# EAGLE schematic schematic-v1 (EAGLE 8.7.0)
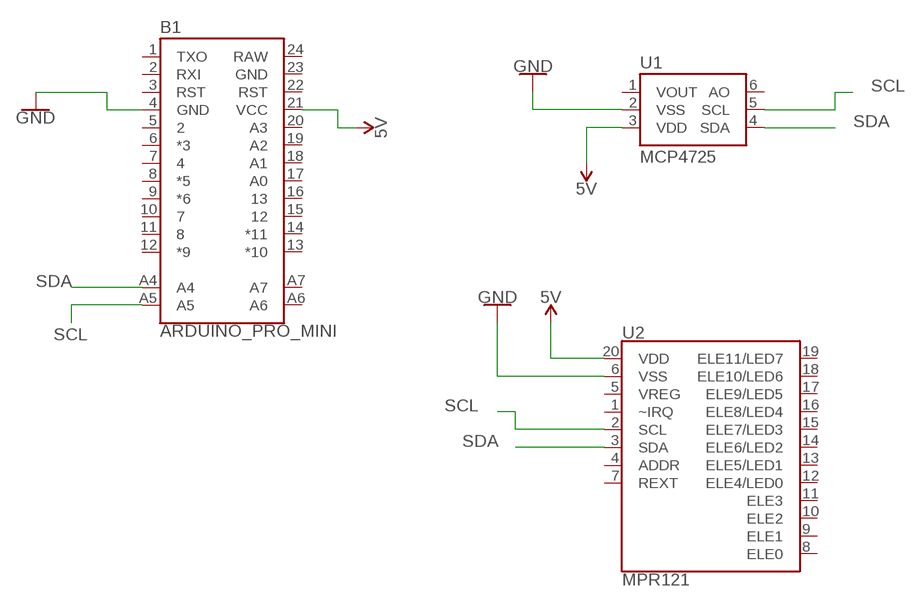
[diagram p0: schematic, sheet 1]

## Parts
B1  ARDUINO_PRO_MINI  [ARDUINO_PRO_MINI]
U1  MCP4725  MCP4725SOT-23  [SOT23-6]
U2  MPR121  [QFN-20]

## Nets
5V: B1.21(VCC) U1.3(VDD) U2.20(VDD)
GND: B1.4(GND) U1.2(VSS) U2.6(VSS)
SCL: B1.A5 U1.5(SCL) U2.2(SCL)
SDA: B1.A4 U1.4(SDA) U2.3(SDA)
Unconnected: B1.1(TXO) B1.2(RXI) B1.3(RST) B1.5 B1.6(*3) B1.7 B1.8(*5) B1.9(*6) B1.10 B1.11 B1.12(*9) B1.13(*10) B1.14(*11) B1.15 B1.16 B1.17(A0) B1.18(A1) B1.19(A2) B1.20(A3) B1.22(RST) B1.A6 B1.A7 U1.1(VOUT) U1.6(AO) U2.1(~IRQ) U2.4(ADDR) U2.5(VREG) U2.7(REXT) U2.8(ELE0) U2.9(ELE1) U2.10(ELE2) U2.11(ELE3) U2.12(ELE4/LED0) U2.13(ELE5/LED1) U2.14(ELE6/LED2) U2.15(ELE7/LED3) U2.16(ELE8/LED4) U2.17(ELE9/LED5) U2.18(ELE10/LED6) U2.19(ELE11/LED7)

## Power pins joined to a net without a drawn wire
GND: B1.23(GND)
RAW: B1.24(RAW)

## Library data of the parts
B1 = SparkFun-Boards:ARDUINO_PRO_MINI: SparkFun Pro Mini Pro Mini compatible footprint. Dimensions: 0.7 x 1.3" PCB Thickness: 0.8mm SparkFun Products: 3.3V/8MHz <https://www.sparkfun.com/products/11114> 5V/16MHz <https://www.sparkfun.com/products/11113>
U1 = SparkFun-IC-Conversion:MCP4725: MCP4725 DAC Microchip 12-bit I2C DAC, SOT23-6 Datasheet <https://cdn.sparkfun.com/datasheets/BreakoutBoards/MCP4725_2009.pdf> SparkFun Products SparkFun I2C DAC Breakout - MCP4725 <https://www.sparkfun.com/products/12918> (BOB-12918); PROD_ID: IC-08886
U2 = SparkFun-Sensors:MPR121: NXP MPR121 Proximity Capacitive Touch Sensor Controller The MPR121 is a capacitive touch sensor controller driven by an I2C interface. The chip can control up to twelve individual electrodes, as well as a simulated thirteenth electrode. The MPR121 also features eight LED driving pins. When these pins are not configured as electrodes, they may be used to drive LEDs. Datasheet <http://www.sparkfun.com/datasheets/Components/MPR121.pdf> SparkFun Products Capacitive Touch Sensor Controller - MPR121QR2 <https://www.sparkfun.com/products/9604> (COM-09604) SparkFun Capacitive Touch Sensor Breakout - MPR121 <https://www.sparkfun.com/products/9695> (SEN-09695) SparkFun Touch Shield <https://www.sparkfun.com/products/12013> (DEV-12013) SparkFun Capacitive Touch Keypad - MPR121 <https://www.sparkfun.com/products/12017> (SEN-12017); PROD_ID: IC-09490; SF_ID: COM-09604